# EAGLE design stabilizator_9V (EAGLE 4.16)
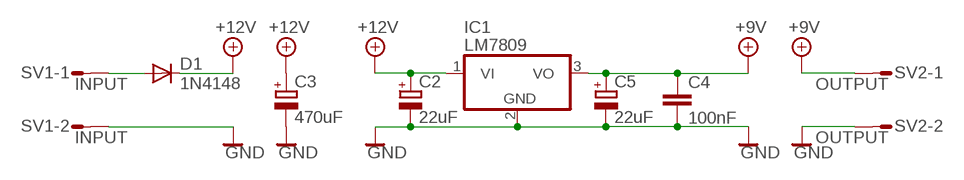
[diagram p0: schematic, sheet 1]

## Parts
C2  22uF  CPOL-EUE5-6  [E5-6]
C3  470uF  CPOL-EUE5-10.5  [E5-10,5]
C4  100nF  C-EU075-032X103  [C075-032X103]
C5  22uF  CPOL-EUE5-6  [E5-6]
D1  1N4148  [DO35-10]
IC1  LM7809  7805T  [TO220H]
SV1  INPUT  L02P  [L02P]
SV2  OUTPUT  L02P  [L02P]

## Nets
0V: C2.- C3.- C4.2 C5.- IC1.2(GND) SV1.2 SV2.2 ; supply symbol labelled GND
+9V: C4.1 C5.+ IC1.3(VO) SV2.1
+12V: C2.+ C3.+ D1.C IC1.1(VI)
N$1: D1.A SV1.1

## Library data of the parts
C2 C3 C5 = rcl:CPOL-EU: POLARIZED CAPACITOR, European symbol
C4 = rcl:C-EU: CAPACITOR, European symbol
D1 = diode:1N4148: DIODE high speed (Philips)
IC1 = linear:78*: Positive VOLTAGE REGULATOR Source: http://cache.national.com/ds/LM/LM78L05.pdf http://www.fairchildsemi.com/ds/LM/LM7805.pdf
SV1 SV2 = con-amp-mt:L02P: AMP MT CONNECTOR

## Board
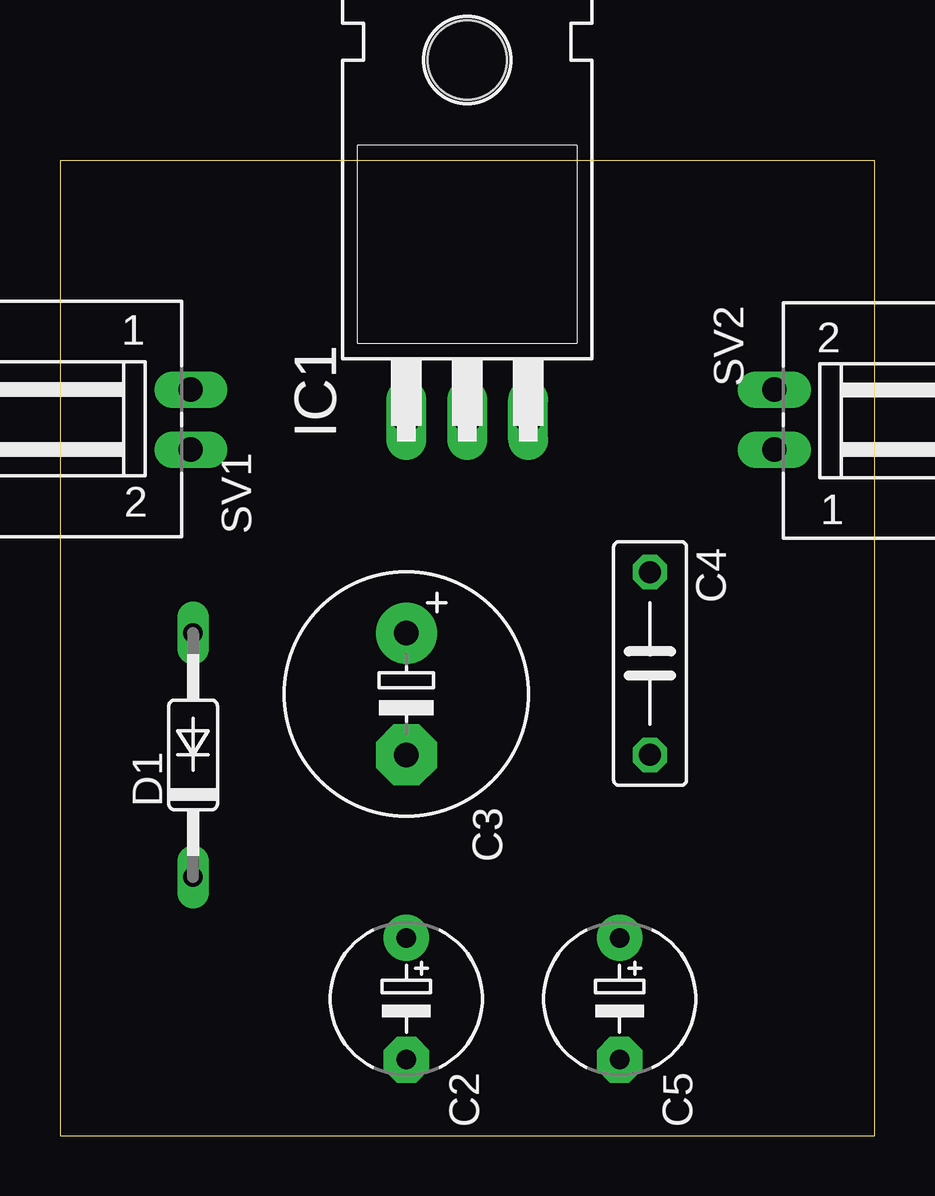
[diagram p1: board, top side]
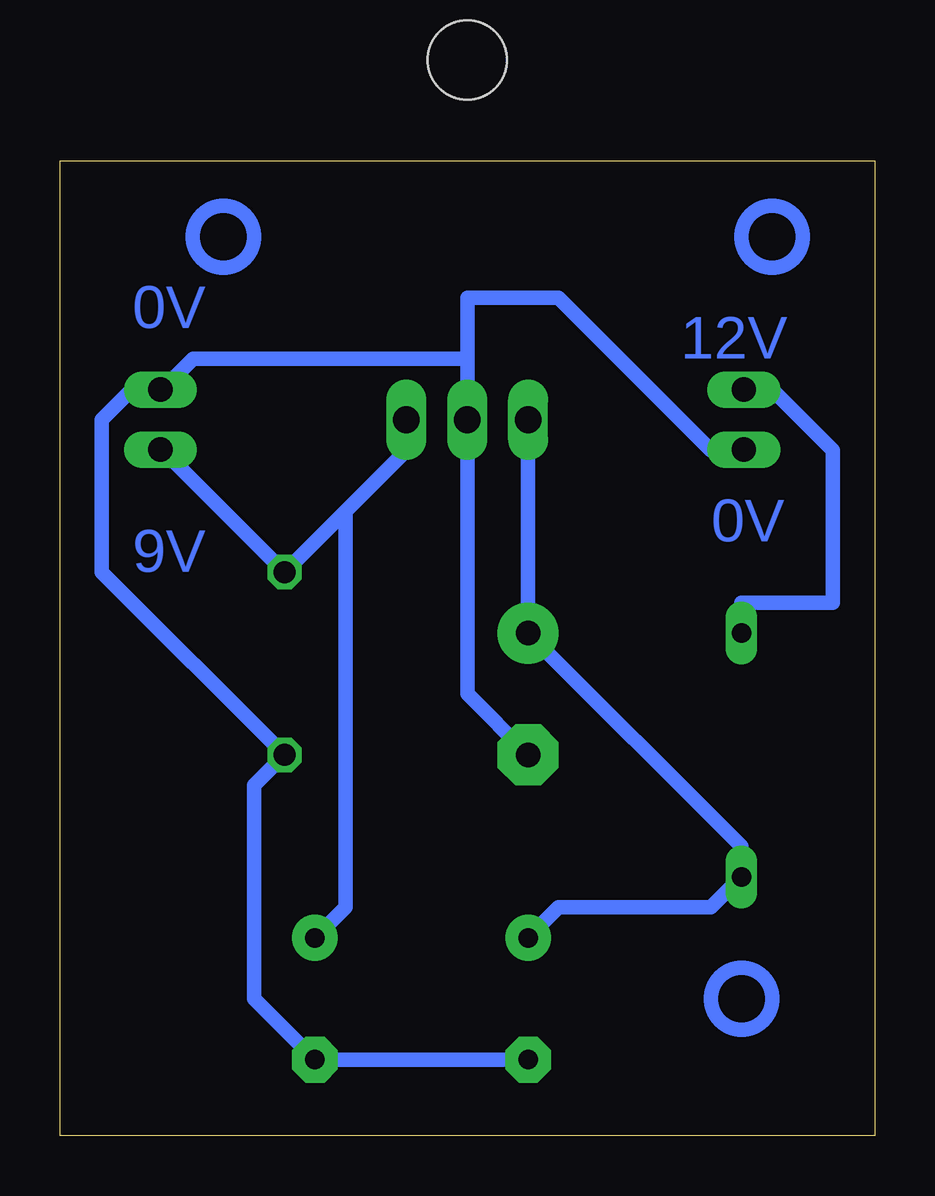
[diagram p2: board, bottom side, seen from below]

Size 33.96 x 40.63 mm. Coordinates in mm from the lower left corner, seen from the top.
Outline: 0,0 33.96,0 33.96,40.63 0,40.63 0,0
Copper layers (1*16): Top 0.035mm / dielectric 1.5mm / Bottom 0.035mm
Design rules "default": minimum track width 10mil, minimum drill 24mil, track to track 8mil, track to pad 8mil, pad to pad 8mil, via to via 8mil, smd to smd 8mil, copper to edge 40mil, drill to drill 8mil, minimum pad ring 10mil, minimum via ring 8mil, stop-mask expansion 4mil, vias tented up to drill 0mil, thermal gap 10mil

### Footprints (pad centres in the part's own frame; a part is rotated, then mirrored left to right if it is on the bottom)
E5-6 = drill 0.813 pad 1.905 round: + -2.54,0 | drill 0.813 pad 1.905 octagon: - 2.54,0
E5-10,5 = drill 1.016 pad 2.54 round: + -2.54,0 | drill 1.016 pad 2.54 octagon: - 2.54,0
C075-032X103 = drill 0.914 octagon: 1 -3.81,0; 2 3.81,0
DO35-10 = drill 0.813 long: A 5.08,0; C -5.08,0
TO220H = drill 1.118 long: 1 -2.54,-10.16; 2 0,-10.16; 3 2.54,-10.16 | hole 3.302: 0,4.826
L02P = drill 1.016 long: 1 1.25,-6.25; 2 -1.25,-6.25

### Placement (x,y rotation side)
C2  14.44,5.71 270 top
C3  14.44,18.41 270 top
C4  24.6,19.68 270 top
C5  23.33,5.71 270 top
D1  5.55,15.87 90 top
IC1  16.98,40 0 top
SV1  -0.8,29.84 90 top
SV2  36.03,29.84 270 top

### Tracks (layer width: path | path; a pad name or v marks a point on that pad's centre or on a via)
0V
  Bottom 0.254: SV2.2 29.68,31.11
  Bottom 0.61: 16.98,32.38 16.98,34.92 13.17,34.92 6.82,28.57 SV1.2 | 16.98,32.38 IC1.2 16.98,18.41 C3.- | SV2.2 30.95,31.11 32.22,29.84 32.22,23.49 C4.2 25.87,14.6 25.87,5.71 C5.- C2.- | 16.98,32.38 28.41,32.38 29.68,31.11
+9V
  Bottom 0.254: 29.68,28.57 SV2.1
  Bottom 0.61: 29.68,28.57 C4.1 22.06,26.03 | 22.06,26.03 19.52,28.57 IC1.3 | C5.+ 22.06,9.52 22.06,26.03
+12V
  Bottom 0.61: IC1.1 C3.+ 5.55,12.06 D1.C 6.82,9.52 13.17,9.52 C2.+
N$1
  Bottom 0.61: D1.A 5.55,22.22 1.74,22.22 1.74,28.57 4.28,31.11 SV1.1
(copper drawn outside any net)
  shapes: Bottom circle x3

### Text on the board
Bottom: 0V | 12V | 0V | 9V